# EAGLE design SparkFun_Thing_Plus_NINA-B306 (EAGLE 9.6.2)
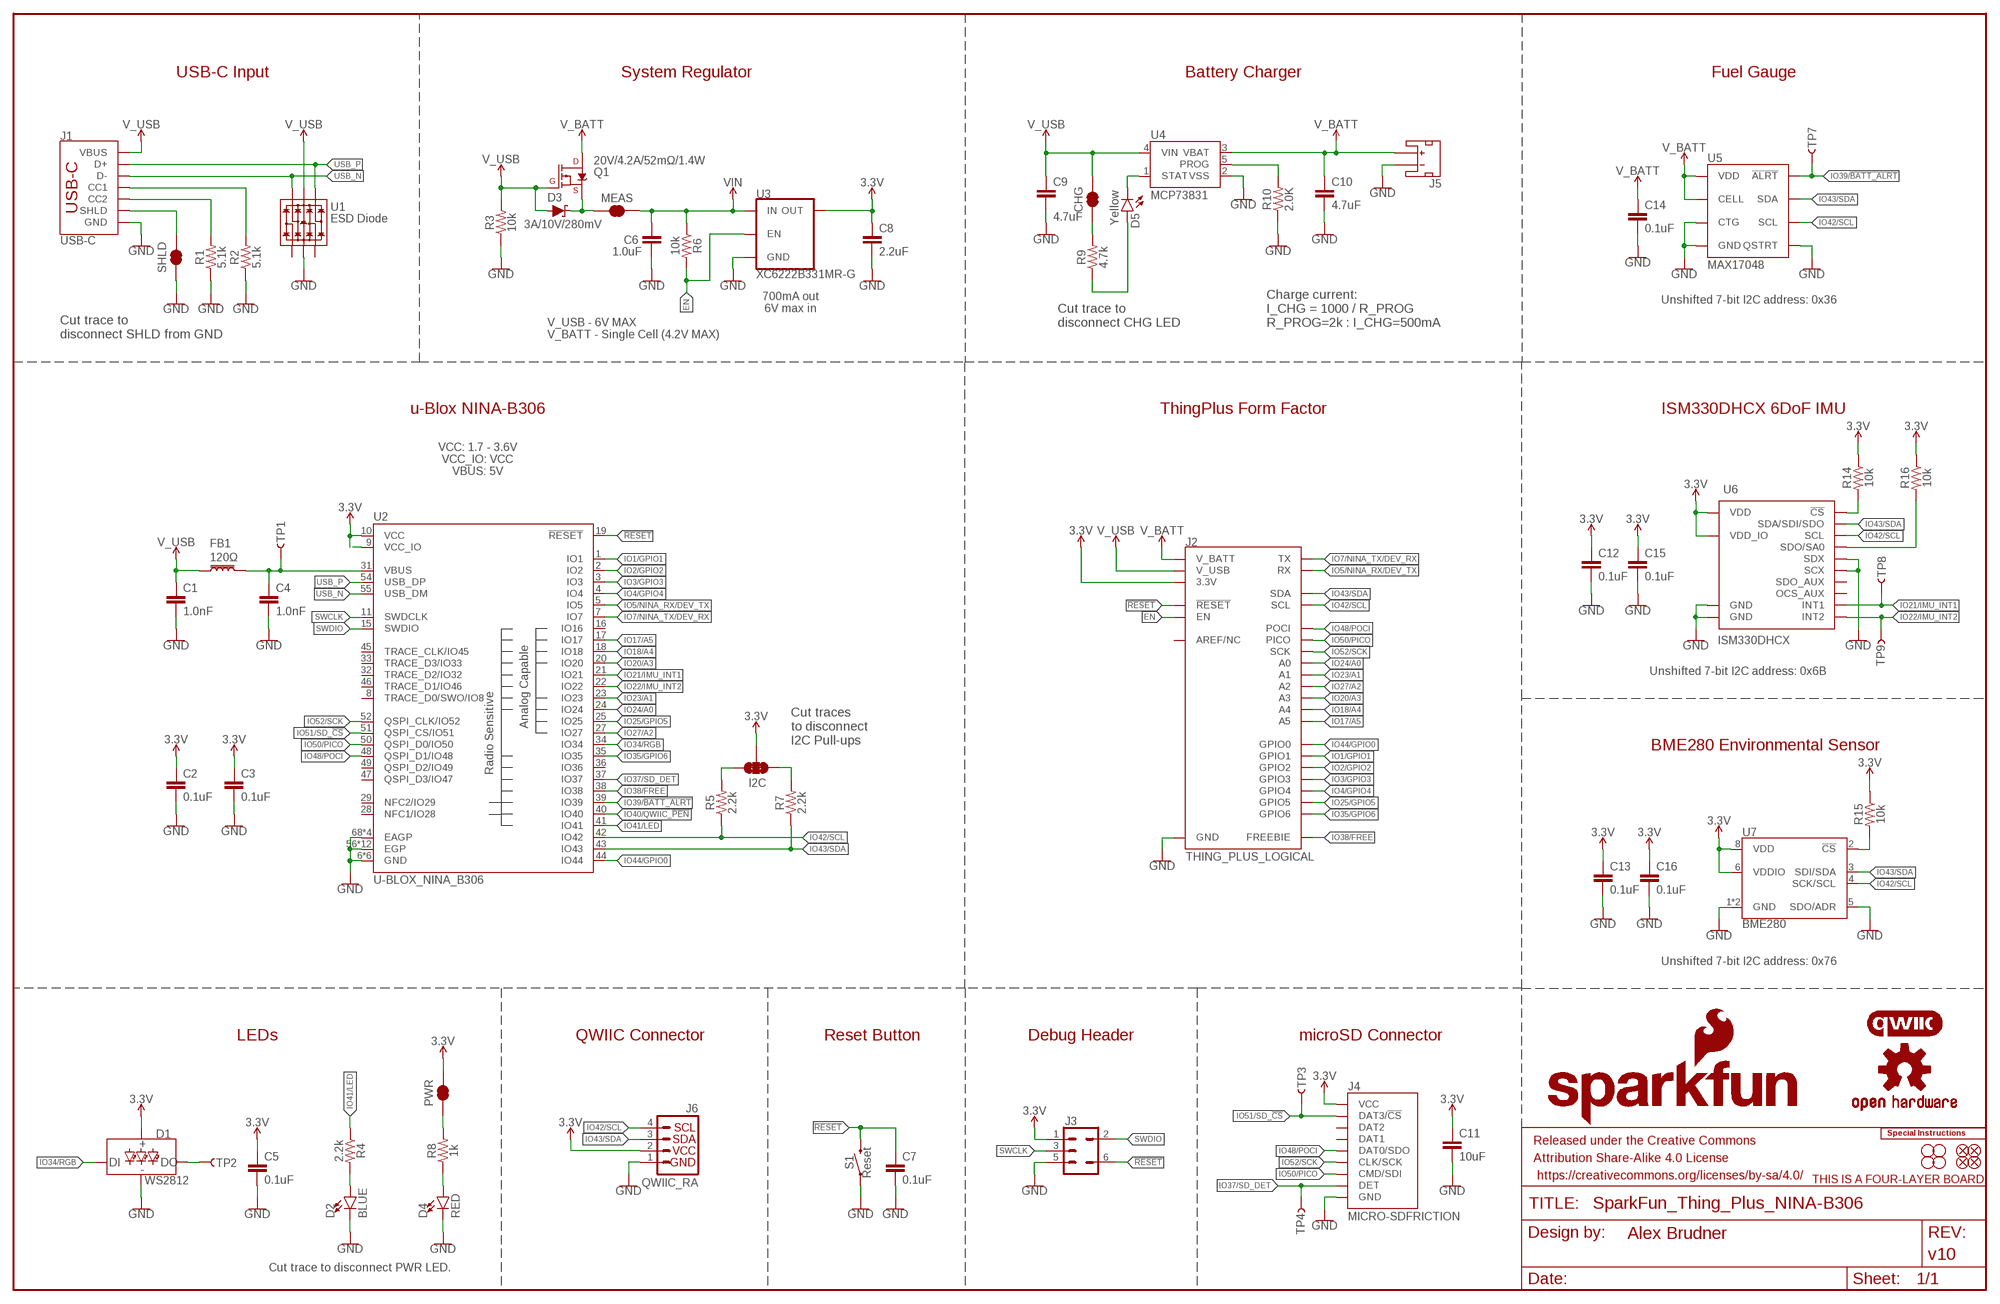
[diagram p0: schematic, sheet 1]

## Parts
C1  1.0nF  1.0NF/1000PF-0402_TIGHT-50V-10%  [0402-TIGHT]
C2  0.1uF  0.1UF-0402T-6.3V-10%-X7R  [0402-TIGHT]
C3  0.1uF  0.1UF-0402T-6.3V-10%-X7R  [0402-TIGHT]
C4  1.0nF  1.0NF/1000PF-0402_TIGHT-50V-10%  [0402-TIGHT]
C5  0.1uF  0.1UF-0402T-6.3V-10%-X7R  [0402-TIGHT]
C6  1.0uF  1.0UF-0402T-16V-10%  [0402-TIGHT]
C7  0.1uF  0.1UF-0402T-10V-10%-X7R  [0402-TIGHT]
C8  2.2uF  2.2UF-0402_TIGHT-10V-10%-X5R  [0402-TIGHT]
C9  4.7uF  4.7UF-0402_TIGHT-6.3V-20%-X5R  [0402-TIGHT]
C10  4.7uF  4.7UF-0402_TIGHT-6.3V-20%-X5R  [0402-TIGHT]
C11  10uF  10UF-0402T-6.3V-20%  [0402-TIGHT]
C12  0.1uF  0.1UF-0402T-6.3V-10%-X7R  [0402-TIGHT]
C13  0.1uF  0.1UF-0402T-6.3V-10%-X7R  [0402-TIGHT]
C14  0.1uF  0.1UF-0402T-10V-10%-X7R  [0402-TIGHT]
C15  0.1uF  0.1UF-0402T-6.3V-10%-X7R  [0402-TIGHT]
C16  0.1uF  0.1UF-0402T-6.3V-10%-X7R  [0402-TIGHT]
CHG  JUMPER-SMT_2_NC_TRACE_SILK  [SMT-JUMPER_2_NC_TRACE_SILK]
D1  WS2812  WS2812_2020  [WS2812-2020]
D2  BLUE  LED-BLUE0603  [LED-0603]
D3  3A/10V/280mV  DIODE-SCHOTTKY-BAT60A  [SOD-323]
D4  RED  LED-RED0603  [LED-0603]
D5  Yellow  LED-YELLOW0603  [LED-0603]
FB1  120Ω  FERRITE_BEAD-120_OHM-0402  [0402]
FD1  FIDUCIALUFIDUCIAL  [FIDUCIAL-MICRO]
FD2  FIDUCIALUFIDUCIAL  [FIDUCIAL-MICRO]
FD3  FIDUCIALUFIDUCIAL  [FIDUCIAL-MICRO]
FD4  FIDUCIALUFIDUCIAL  [FIDUCIAL-MICRO]
FRAME1  FRAME-LEDGER  [CREATIVE_COMMONS]
H1  STAND-OFFTIGHT  [STAND-OFF-TIGHT]
H2  STAND-OFFTIGHT  [STAND-OFF-TIGHT]
H3  STAND-OFFTIGHT  [STAND-OFF-TIGHT]
H4  STAND-OFFTIGHT  [STAND-OFF-TIGHT]
I2C  JUMPER-SMT_3_2-NC_TRACE_SILK  [SMT-JUMPER_3_2-NC_TRACE_SILK]
J1  USB-C  USB_C_4-LAYER-ISOLATED  [USB-C-16P-4LAYER-ISOLATED]
J2  THING_PLUS_LOGICAL  [THING_PLUS]
J3  CONN_03X2_NO4  [PAD_05_03X2_TP_NO4]
J4  MICRO-SDFRICTION  [MICROSD_TINY]
J5  JST_2MM_MALE  [JST-2-SMD]
J6  QWIIC_RA  QWIIC_CONNECTORJS-1MM  [JST04_1MM_RA]
LOGO1  SFE_LOGO_NAME_FLAME.1_INCH  [SFE_LOGO_NAME_FLAME_.1]
LOGO2  FOUR_LAYER_WARNING  [FOUR_LAYER_WARNING]
LOGO3  SPECIAL_INSTRUCTIONS-ORDERING  [ORDERING_INSTRUCTIONS]
LOGO4  QWIIC_LOGO_4MM  [QWIIC_4MM]
LOGO5  OSHW-LOGOMINI  [OSHW-LOGO-MINI]
MEAS  JUMPER-COMBO_2_NC_TRACE  [COMBO-JUMPER_2_NC_TRACE]
PWR  JUMPER-SMT_2_NC_TRACE_SILK  [SMT-JUMPER_2_NC_TRACE_SILK]
Q1  20V/4.2A/52mΩ/1.4W  MOSFET_PCH-DMG2305UX-7  [SOT23-3]
R1  5.1k  5.1KOHM-0402T-1/16W-1%  [0402-TIGHT]
R2  5.1k  5.1KOHM-0402T-1/16W-1%  [0402-TIGHT]
R3  10k  10KOHM-0402T-1/16W-1%  [0402-TIGHT]
R4  2.2k  2.2KOHM-0402T-1/16W-1%  [0402-TIGHT]
R5  2.2k  2.2KOHM-0402T-1/16W-1%  [0402-TIGHT]
R6  10k  10KOHM-0402T-1/16W-1%  [0402-TIGHT]
R7  2.2k  2.2KOHM-0402T-1/16W-1%  [0402-TIGHT]
R8  1k  1KOHM-0402T-1/16W-1%  [0402-TIGHT]
R9  4.7k  4.7KOHM-0402T-1/16W-1%  [0402-TIGHT]
R10  2.0K  2.0KOHM-0402T-1/16W-1%  [0402-TIGHT]
R14  10k  10KOHM-0402T-1/16W-1%  [0402-TIGHT]
R15  10k  10KOHM-0402T-1/16W-1%  [0402-TIGHT]
R16  10k  10KOHM-0402T-1/16W-1%  [0402-TIGHT]
S1  Reset  MOMENTARY-SWITCH-SPST-SMD-4.6X2.8MM  [TACTILE_SWITCH_SMD_4.6X2.8MM]
SHLD  JUMPER-SMT_2_NC_TRACE_SILK  [SMT-JUMPER_2_NC_TRACE_SILK]
TP1  TEST-POINT3X5  [PAD.03X.05]
TP2  TEST-POINT3X5  [PAD.03X.05]
TP3  TEST-POINT3X5  [PAD.03X.05]
TP4  TEST-POINT3X5  [PAD.03X.05]
TP7  TEST-POINT3X5  [PAD.03X.05]
TP8  TEST-POINT3X5  [PAD.03X.05]
TP9  TEST-POINT3X5  [PAD.03X.05]
U1  ESD Diode  TVS_DIODE_ARRAY_DT1042-04SO-7  [SOT-23-6]
U2  U-BLOX_NINA_B306  [NINA_B306]
U3  XC6222B331MR-G  [SOT23-5]
U4  MCP73831  [SOT23-5]
U5  MAX17048  MAX17048DFN8  [DFN-8]
U6  ISM330DHCX  [LGA-14L]
U7  BME280  [LGA-8-2.5X2.5]

## Nets
3.3V [power]: C2.1 C3.1 C5.1 C8.1 C11.1 C12.1 C13.1 C15.1 C16.1 D1.VCC I2C.2 J2.27(3.3V) J3.1 J4.4(VCC) J6.2 PWR.2 R14.1 R15.1 R16.1 U2.9(VCC_IO) U2.10(VCC) U3.5(OUT) U6.P5(VDD_IO) U6.P8(VDD) U7.6(VDDIO) U7.8(VDD)
!RESET!: C7.1 J2.28(!RESET) J3.6 S1.3 S1.4 U2.19(!RESET!)
EN: J2.11(EN) R6.2 U3.3(EN)
GND [ground]: C1.2 C2.2 C3.2 C4.2 C5.2 C6.2 C7.2 C8.2 C9.2 C10.2 C11.2 C12.2 C13.2 C14.2 C15.2 C16.2 D1.GND D2.C D4.C J1.GND J1.GND2(GND) J2.25(GND) J3.5 J4.6(GND) J4.GND1(GND) J4.GND2(GND) J4.GND3(GND) J4.GND4(GND) J4.GND5(GND) J4.GND6(GND) J5.1(-) J6.1 R1.1 R2.1 R3.1 R10.1 S1.1 S1.2 SHLD.1 U1.2(VSS) U2.6(GND) U2.12(GND) U2.14(GND) U2.26(GND) U2.30(GND) U2.53(GND) U2.56(EGP) U2.57(EGP) U2.58(EGP) U2.59(EGP) U2.60(EGP) U2.61(EGP) U2.62(EGP) U2.63(EGP) U2.64(EGP) U2.65(EGP) U2.66(EGP) U2.67(EGP) U2.68(EAGP) U2.69(EAGP) U2.70(EAGP) U2.71(EAGP) U3.2(GND) U4.2(VSS) U5.1(CTG) U5.4(GND) U5.6(QSTRT) U5.9(GND) U6.P2(SDX) U6.P3(SCX) U6.P6(GND) U6.P7(GND) U7.1(GND) U7.5(SDO/ADR) U7.7(GND)
IO1/GPIO1: J2.8(GPIO1) U2.1(IO1)
IO2/GPIO2: J2.7(GPIO2) U2.2(IO2)
IO3/GPIO3: J2.6(GPIO3) U2.3(IO3)
IO4/GPIO4: J2.5(GPIO4) U2.4(IO4)
IO5/NINA_RX/DEV_TX [HS_digital]: J2.15(RX) U2.5(IO5)
IO7/NINA_TX/DEV_RX [HS_digital]: J2.14(TX) U2.7(IO7)
IO17/A5 [analog]: J2.19(A5) U2.17(IO17)
IO18/A4 [analog]: J2.20(A4) U2.18(IO18)
IO20/A3 [analog]: J2.21(A3) U2.20(IO20)
IO21/IMU_INT1: TP8.1 U2.21(IO21) U6.P4(INT1)
IO22/IMU_INT2: TP9.1 U2.22(IO22) U6.P9(INT2)
IO23/A1 [analog]: J2.23(A1) U2.23(IO23)
IO24/A0 [analog]: J2.24(A0) U2.24(IO24)
IO25/GPIO5: J2.4(GPIO5) U2.25(IO25)
IO27/A2 [analog]: J2.22(A2) U2.27(IO27)
IO34/RGB: D1.DI U2.34(IO34)
IO35/GPIO6: J2.3(GPIO6) U2.35(IO35)
IO37/SD_DET: J4.9(DET) TP4.1 U2.37(IO37)
IO38/FREE: J2.13(FREEBIE) U2.38(IO38)
IO39/!BATT_ALRT!: TP7.1 U2.39(IO39) U5.5(!ALRT)
IO40/QWIIC_!PEN!: U2.40(IO40)
IO41/LED: R4.1 U2.41(IO41)
IO42/SCL [HS_digital]: J2.2(SCL) J6.4 R5.1 U2.42(IO42) U5.7(SCL) U6.P13(SCL) U7.4(SCK/SCL)
IO43/SDA [HS_digital]: J2.1(SDA) J6.3 R7.1 U2.43(IO43) U5.8(SDA) U6.P14(SDA/SDI/SDO) U7.3(SDI/SDA)
IO44/GPIO0: J2.9(GPIO0) U2.44(IO44)
IO48/POCI [HS_digital]: J2.16(POCI) J4.7(DAT0/SDO) U2.48(QSPI_D1/IO48)
IO50/PICO [HS_digital]: J2.17(PICO) J4.3(CMD/SDI) U2.50(QSPI_D0/IO50)
IO51/SD_!CS!: J4.2(DAT3/!CS!) TP3.1 U2.51(QSPI_CS/IO51)
IO52/SCK [HS_digital]: J2.18(SCK) J4.5(CLK/SCK) U2.52(QSPI_CLK/IO52)
N$2: J1.B5(CC2) R1.2
N$3: J1.A5(CC1) R2.2
N$4: D5.A R9.1
N$5: D5.C U4.1(STAT)
N$6: R10.2 U4.5(PROG)
N$8: CHG.1 R9.2
N$10: D4.A R8.1
N$11: PWR.1 R8.2
N$12 [power]: D3.C MEAS.1 MEAS.3 Q1.2(S)
N$14: D1.DO TP2.1
N$15: R15.2 U7.2(!CS)
N$16: D2.A R4.2
N$18: R14.2 U6.P12(!CS!)
N$19: R16.2 U6.P1(SDO/SA0)
N$20: C4.1 FB1.2 TP1.1 U2.31(VBUS)
SCL_PU_PWR: I2C.3 R5.2
SDA_PU_PWR: I2C.1 R7.2
SHLD [ground]: J1.SHLD1(SHLD) J1.SHLD2(SHLD) J1.SHLD3(SHLD) J1.SHLD4(SHLD) J1.SHLD5(SHLD) J1.SHLD6(SHLD) J1.SHLD7(SHLD) J1.SHLD8(SHLD) SHLD.2
SWCLK [HS_digital]: J3.3 U2.11(SWDCLK)
SWDIO [HS_digital]: J3.2 U2.15(SWDIO)
USB_N [usb_diff]: J1.A7(D-) J1.B7(D-) U1.6(IO4) U2.55(USB_DM)
USB_P [usb_diff]: J1.A6(D+) J1.B6(D+) U1.4(IO3) U2.54(USB_DP)
V_BATT [power]: C10.1 C14.1 J2.12(V_BATT) J5.2(+) Q1.3(D) U4.3(VBAT) U5.2(CELL) U5.3(VDD)
V_USB [power]: C1.1 C9.1 CHG.2 D3.A FB1.1 J1.VBUS1(VBUS) J1.VBUS2(VBUS) J2.10(V_USB) Q1.1(G) R3.2 U1.5(VCC) U4.4(VIN)
VIN [power]: C6.1 MEAS.2 MEAS.4 R6.1 U3.1(IN)
Unconnected: J2.26(AREF/NC) J4.1(DAT2) J4.8(DAT1) J5.NC1(PAD1) J5.NC2(PAD2) U1.1(IO1) U1.3(IO2) U2.8(TRACE_D0/SWO/IO8) U2.16(IO16) U2.28(NFC1/IO28) U2.29(NFC2/IO29) U2.32(TRACE_D2/IO32) U2.33(TRACE_D3/IO33) U2.36(IO36) U2.45(TRACE_CLK/IO45) U2.46(TRACE_D1/IO46) U2.47(QSPI_D3/IO47) U2.49(QSPI_D2/IO49) U6.P10(OCS_AUX) U6.P11(SDO_AUX)

## Notes on the sheet
- USB-C Input | System Regulator | Battery Charger | Fuel Gauge
- 700mA out
  6V max in
- Unshifted 7-bit I2C address: 0x36
- Cut trace to 
  disconnect CHG LED
- Charge current:
  I_CHG = 1000 / R_PROG
  R_PROG=2k : I_CHG=500mA
- Cut trace to 
  disconnect SHLD from GND
- V_USB - 6V MAX
  V_BATT - Single Cell (4.2V MAX)
- u-Blox NINA-B306 | ThingPlus Form Factor | ISM330DHCX 6DoF IMU
- VCC: 1.7 - 3.6V
  VCC_IO: VCC
  VBUS: 5V
- Unshifted 7-bit I2C address: 0x6B
- Cut traces 
  to disconnect 
  I2C Pull-ups
- BME280 Environmental Sensor
- Unshifted 7-bit I2C address: 0x76
- LEDs | QWIIC Connector | Reset Button | Debug Header | microSD Connector
- Cut trace to disconnect PWR LED.

## Library data of the parts
C1 C4 = SparkFun-Capacitors:1.0NF/1000PF: 1nF/1,000pF ceramic capacitors A capacitor is a passive two-terminal electrical component used to store electrical energy temporarily in an electric field.; PROD_ID: CAP-14280
C2 C3 C5 C12 C13 C15 C16 = SparkFun-Capacitors:0.1UF: 0.1µF ceramic capacitors A capacitor is a passive two-terminal electrical component used to store electrical energy temporarily in an electric field.; PROD_ID: CAP-14993
C6 = SparkFun-Capacitors:1.0UF: 1µF ceramic capacitors A capacitor is a passive two-terminal electrical component used to store electrical energy temporarily in an electric field.; PROD_ID: CAP-12417
C7 C14 = SparkFun-Capacitors:0.1UF: 0.1µF ceramic capacitors A capacitor is a passive two-terminal electrical component used to store electrical energy temporarily in an electric field.; PROD_ID: CAP-15083
C8 = SparkFun-Capacitors:2.2UF: 2.2µF ceramic capacitors A capacitor is a passive two-terminal electrical component used to store electrical energy temporarily in an electric field.; PROD_ID: CAP-14232
C9 C10 = SparkFun-Capacitors:4.7UF: 4.7µF ceramic capacitors A capacitor is a passive two-terminal electrical component used to store electrical energy temporarily in an electric field.; PROD_ID: CAP-14240
C11 = SparkFun-Capacitors:10UF: 10.0µF ceramic capacitors A capacitor is a passive two-terminal electrical component used to store electrical energy temporarily in an electric field.; PROD_ID: CAP-14848
CHG PWR SHLD = SparkFun-Jumpers:JUMPER-SMT_2_NC_TRACE: Normally closed trace jumper This jumper has a trace between two pads so it's normally closed (NC). Use a razor knife to open the connection. For best results follow the IPC guidelines for cutting traces: Cutout at least 0.063 mm (0.005 in). Remove all loose material to clean up the cut area. Seal the cut with an approved epoxy. Reapply solder to reclose the connection.
D1 = SparkFun-LED:WS2812: Addressable RGB LED - 1 Wire Common names: WS2812, SK6812, Neopixel, APA-106, etc. SMD LED with built-in controller IC. Color: Red/Green/Blue SparkFun Products: LED-SMD RGB (WS2812) <https://www.sparkfun.com/products/11821> LED - RGB Addressable, PTH, 5mm Diffused (5 Pack) <https://www.sparkfun.com/products/12986> LED - RGB Addressable, PTH, 5mm Clear (5 Pack) <https://www.sparkfun.com/products/12999> Blynk Board - ESP8266 <https://www.sparkfun.com/products/13794> Datasheet referenced for footprint: WS2812B-PTH <https://cdn.sparkfun.com/datasheets/Components/LED/COM-12877.pdf>; PROD_ID: DIO-15591
D2 = SparkFun-LED:LED-BLUE: Blue SMD LED Used in manufacturing of various products at SparkFun Packages: 0603 - SMD 0603 package [Product Link] <http://www.digikey.com/product-detail/en/SMLE12BC7TT86/511-1589-2-ND/1641808> 1206 - SMD1206 package [Product Link] <http://www.digikey.com/product-detail/en/lite-on-inc/LTST-C150TBKT/160-1643-1-ND/573584> SparkFun Products: ESP8266 Thing-Dev Board <https://www.sparkfun.com/products/13711> RedBoard <https://www.sparkfun.com/products/12757>; PROD_ID: DIO-08575
D3 = SparkFun-DiscreteSemi:DIODE-SCHOTTKY: Schottky diode A Schottky diode is a semiconductor diode which has a low forward voltage drop and a very fast switching action.; PROD_ID: DIO-14072
D4 = SparkFun-LED:LED-RED: Red SMD LED Used in manufacturing of most products at SparkFun Packages: 0603 - SMD 0603 package [Product Link] <http://docs.avagotech.com/docs/AV02-0551EN> 0603 SMART - SMD 0603 SMART package ( more efficient and expensive)[Product Link] <http://www.osram-os.com/Graphics/XPic2/00077099_0.pdf> 1206 - SMD1206 package [Product Link] <https://www.sparkfun.com/datasheets/DevTools/LilyPad/Q150OVS4.pdff> SparkFun Products: Pro Mini 328 -5V <https://www.sparkfun.com/products/821> RedBoard <https://www.sparkfun.com/products/12757> IOIO-OTG <https://www.sparkfun.com/products/13613>; PROD_ID: DIO-00819
D5 = SparkFun-LED:LED-YELLOW: Yellow SMD LED Used in manufacturing several products at SparkFun. Packages: 0603 - SMD 0603 package[Product Link] <http://www.kingbrightusa.com/product.asp?catalog_name=LED&product_id=APT1608SYCK> 0603 -SMART - SMART SMD 0603 package (more efficient/more expensive) [Product Link] <http://www.osram-os.com/osram_os/en/products/product-catalog/led-light-emitting-diodes/smartled-0603/ly-l29k/index.jsp> LilyPad - SMD1206 package[Product Datasheet] <https://www.sparkfun.com/datasheets/DevTools/LilyPad/Q150YUS4.pdf> SparkFun Products: Blynk Board <https://www.sparkfun.com/products/13794> IOIO-OTG <https://www.sparkfun.com/products/13613> XBee Explorer Serial <https://www.sparkfun.com/products/13225>; PROD_ID: DIO-09003
FB1 = SparkFun-Coils:FERRITE_BEAD-120_OHM: Ferrite Bead (blocks, cores, rings, chokes, etc.) Inductor with layers of ferrite used to suppress high frequencies. Often used to isolate high frequency noise.; MFG_PART: BLM15HB121SN1D; PROD_ID: NDUC-14206
FD1-FD4 = SparkFun-Aesthetics:FIDUCIAL: Fiducial Alignment Points Point-of-reference for pick-and-place machines and other optical instruments.
FRAME1 = SparkFun-Aesthetics:FRAME-LEDGER: Schematic Frame - Ledger Standard 11x14 US Ledger frame; DESIGNER: Alex Brudner; REV: v10
H1-H4 = SparkFun-Hardware:STAND-OFF: Stand Off Drill holes for mechanically mounting via screws, standoffs, etc. Note: Use the keepout ring to avoid running the screw head into surrounding components. Variant Overviews STAND-OFF - Mechanical footprint for a #4 phillips button head screw. STAND-OFF-TIGHT - Mechanical footprint for a #4 phillips button head screw, Example SparkFun Products Screw - Phillips Head (1/4", 4-40, 10 pack) <https://www.sparkfun.com/products/10453> (PRT-10453) Screw - Phillips Head (1/2", 4-40, 10 pack) <https://www.sparkfun.com/products/10452> (PRT-10452) Screw - Phillips Head (3/4", 4-40, 10 pack) <https://www.sparkfun.com/products/10451> (PRT-10451) Screw - Phillips Head (1", 4-40, 10 pack) <https://www.sparkfun.com/products/10450> (PRT-10450)
I2C = SparkFun-Jumpers:JUMPER-SMT_3_2-NC_TRACE: Normally closed trace jumper (2 of 2 connections) This jumper has a trace between all three pads so they are normally closed (NC). Use a razor knife to open the connection(s). For best results follow the IPC guidelines for cutting traces: Cutout at least 0.063 mm (0.005 in). Remove all loose material to clean up the cut area. Seal the cut with an approved epoxy. Reapply solder to reclose the connection(s).
J1 = SparkFun-Connectors:USB_C: USB Type C 16Pin Connector Super Speed pins not available on the 16-pin purely SMD connector so this part is best for USB 2.0 implementations. D1 and D2 are tied together enabling D+/- no matter which way the cable is plugged into the connector. The two channel configuration pins (CC1/2) are exposed. These are normally connected to ground via 5.1k resistors but can be reconfigured for high current/high power applications. **4-LAYER BOARD WARNING!!** If designing 4-layer board, make sure to select the variant _4-LAYER-ISOLATED. The linked footprint (USB-C-16-4LAYER-ISOLATED) includes some very necessary cutout polygons in the inner layers (2 and 15). This prevents the PTH mounting shield legs on the USB connector from electrically connecting any other polygons on the inner layers (usually VCC and GND).; PROD_ID: CONN-14122; VALUE: USB Female Type C Connector
J2 = SparkFun-Boards:THING_PLUS_LOGICAL
J3 = MISC:CONN_03X2_NO4
J4 = SparkFun-Connectors:MICRO-SD: microSD Socket for Transflash Various sockets for µSD. tDoc lines correctly indicate media card edge positions when inserting (unlocked, locked, depressed). NOTE: CD1 and CD2 are connected internally, and the default detect state of the socket is detect pin to ground. SparkFun Products: WAV Trigger <https://www.sparkfun.com/products/13660> CAN-Bus Shield <https://www.sparkfun.com/products/13262> SparkFun Level Shifing microSD Breakout <https://www.sparkfun.com/products/13743>; PROD_ID: CONN-13500
J5 = SparkFun-Connectors:JST_2MM_MALE: JST 2MM MALE RA CONNECTOR Two pin, compact surface mount connector. Commonly used as a battery input connection point. We really like the solid locking feeling and high current rating on these small connectors. We use these all the time as battery connectors. Mates to single-cell LiPo batteries. Here is the connector we sell at SparkFun: JST Right Angle Connector - White <https://www.sparkfun.com/products/8612> (PRT-08612) Datasheet <http://www.sparkfun.com/datasheets/Prototyping/Connectors/JST-Horizontal.pdf> It was used on these SparkFun products: SparkFun MOSFET Power Controller <https://www.sparkfun.com/products/11214> (PRT-11214) SparkFun Battery Babysitter - LiPo Battery Manager <https://www.sparkfun.com/products/13777> (PRT-13777) And many, many others that required a lipo battery connection.; PROD_ID: CONN-11443; SF_ID: PRT-08612
J6 = SparkFun-Connectors:QWIIC_CONNECTOR: SparkFun I2C Standard Qwiic Connector An SMD 1mm pitch JST connector makes it easy and quick (get it? Qwiic?) to connect I2C devices to each other. The Qwiic system <http://www.sparkfun.com/qwiic> enables fast and solderless connection between popular platforms and various sensors and actuators. We carry 200mm <https://www.sparkfun.com/products/14204>, 100mm <https://www.sparkfun.com/products/14205>, 50mm <https://www.sparkfun.com/products/14206>, and breadboard friendly <https://www.sparkfun.com/products/14207> Qwiic cables. We also offer 10 pcs strips <https://www.sparkfun.com/products/14323> the SMD connectors.; PROD_ID: CONN-13694; VALUE: QWIIC_RIGHT_ANGLE
LOGO1 = SparkFun-Aesthetics:SFE_LOGO_NAME_FLAME: SparkFun Font Logo w/ Flame This is the SparkFun full logo. The logo on the schematic will always be the same size; the package variant is the height of the flame part of the logo. Default layer for the logo on the board is tSilk.
LOGO2 = SparkFun-Aesthetics:FOUR_LAYER_WARNING: Four-Layer Board Warning - tDoc Layer Warning text which will appear on both the schematic and the board file, notifying viewers that the design is a four-layer PCB.
LOGO3 = SparkFun-Aesthetics:SPECIAL_INSTRUCTIONS: Special Ordering/Production Instructions Alert Symbol for special PCB ordering instructions or unique production process warnings. Ordering Instructions Production Instructions Types of information that should be added to box: Copper weight Soldermask color Silk color PCB thickness Number of layers PCB Standard: 1.6mm FR4 1 oz copper immersion silver plating red soldermask white silkscreen Types of information that should be added to box: Special wash requirements Depaneling instructions Humidification Glue curing Default text settings: 0.07 inch 9% ratio 50% line distance
LOGO4 = SparkFun-Aesthetics:QWIIC_LOGO: Qwiic Logos for placement on schematic and PCB. The 5.5mm silk logo is best for placing next to Qwiic connector.
LOGO5 = SparkFun-Aesthetics:OSHW-LOGO: Open-Source Hardware (OSHW) Logo This logo indicates the piece of hardware it is found on incorporates a OSHW license and/or adheres to the definition of open source hardware found here: http://freedomdefined.org/OSHW
MEAS = SparkFun-Jumpers:JUMPER-COMBO_2_NC_TRACE
Q1 = SparkFun-DiscreteSemi:MOSFET_PCH: P-channel MOSFETs Voltage controlled devices that allow control of high current outputs. SparkFun Products: SparkFun ESP32 Thing <https://www.sparkfun.com/products/13907> SparkFun ESP8266 Thing <https://www.sparkfun.com/products/13231> SparkFun Pi Servo HAT V2 <https://www.sparkfun.com/products/15316> DMG2305UX-7 (20V/4.2A/SOT23-3); PROD_ID: TRANS-14388
R1 R2 = SparkFun-Resistors:5.1KOHM; PROD_ID: RES-14340
R3 R6 R14-R16 = SparkFun-Resistors:10KOHM: 10kΩ resistor A resistor is a passive two-terminal electrical component that implements electrical resistance as a circuit element. Resistors act to reduce current flow, and, at the same time, act to lower voltage levels within circuits. - Wikipedia; PROD_ID: RES-14241
R4 R5 R7 = SparkFun-Resistors:2.2KOHM: 2.2kΩ resistor A resistor is a passive two-terminal electrical component that implements electrical resistance as a circuit element. Resistors act to reduce current flow, and, at the same time, act to lower voltage levels within circuits. - Wikipedia; PROD_ID: RES-14341
R8 = SparkFun-Resistors:1KOHM: 1kΩ resistor A resistor is a passive two-terminal electrical component that implements electrical resistance as a circuit element. Resistors act to reduce current flow, and, at the same time, act to lower voltage levels within circuits. - Wikipedia; PROD_ID: RES-14342
R9 = SparkFun-Resistors:4.7KOHM: 4.7kΩ resistor A resistor is a passive two-terminal electrical component that implements electrical resistance as a circuit element. Resistors act to reduce current flow, and, at the same time, act to lower voltage levels within circuits. - Wikipedia; PROD_ID: RES-15343
R10 = SparkFun-Resistors:2.0KOHM: 2kΩ resistor A resistor is a passive two-terminal electrical component that implements electrical resistance as a circuit element. Resistors act to reduce current flow, and, at the same time, act to lower voltage levels within circuits. - Wikipedia; PROD_ID: RES-15406
S1 = SparkFun-Switches:MOMENTARY-SWITCH-SPST: Momentary Switch (Pushbutton) - SPST Normally-open (NO) SPST momentary switches (buttons, pushbuttons). Variants PTH-12MM - 12mm square, through-hole Momentary Pushbutton Switch - 12mm Square <https://www.sparkfun.com/products/9190> (COM-09190) PTH-6.0MM, PTH-6.0MM-KIT - 6.0mm square, through-hole Mini Pushbutton Switch <https://www.sparkfun.com/products/97> (COM-00097) KIT package intended for soldering kit's - only one side of pads' copper is exposed. PTH-RIGHT-ANGLE-KIT - Right-angle, through-hole Right Angle Tactile Button <https://www.sparkfun.com/products/10791> - Used on SparkFun BigTime Watch Kit <https://www.sparkfun.com/products/11734> SMD-12MM - 12mm square, surface-mount Tactile Button - SMD (12mm) <https://www.sparkfun.com/products/12993> (COM-12993) Used on SparkFun PicoBoard <https://www.sparkfun.com/products/11888> SMD-4.5MM - 4.5mm Square Trackball Switch Used on SparkFun Blackberry Trackballer Breakout <https://www.sparkfun.com/products/13169> SMD-4.6MMX2.8MM - 4.60mm x 2.80mm, surface mount Used on SparkFun Pro Micro - RP2040 <https://www.sparkfun.com/products/17717> SMD-5.2MM, SMD-5.2-REDUNDANT - 5.2mm square, surface-mount Mini Pushbutton Switch - SMD <https://www.sparkfun.com/products/8720> (COM-08720) Used on Arduino Pro Mini <https://www.sparkfun.com/products/11114> REDUNDANT package connects both switch circuits together SMD-6.0X3.5MM - 6.0 x 3.5mm, surface mount Momentary Reset Switch SMD <https://www.sparkfun.com/products/8229> (COM-08229) SMD-6.2MM-TALL - 6.2mm square, surface mount Tactile Button - SMD (6mm) <https://www.sparkfun.com/products/12992> Used on SparkFun Digital Sandbox <https://www.sparkfun.com/products/12651> SMD-RIGHT-ANGLE - Right-angle, surface mount Used on SparkFun Block for Intel® Edison - Arduino <https://www.sparkfun.com/products/13036>; PROD_ID: SWCH-15606
TP1-TP4 TP7-TP9 = SparkFun-Connectors:TEST-POINT: SparkFun Test Points Bare copper test points for troubleshooting or In-Circuit-Testing. These are used by our Production team for verifying production board runs using pogo-pins on test beds. SparkFun Products: SparkFun LSM9DS1 Breakout <https://www.sparkfun.com/products/13284> SparkFun PSOC <https://www.sparkfun.com/products/13714> SparkFun Load Cell Amplifier <https://www.sparkfun.com/products/13879>
U1 = SparkFun-DiscreteSemi:TVS_DIODE_ARRAY; PROD_ID: IC-13538
U2 = U-BLOX_NINA_B306:U-BLOX_NINA_B306: u-blox NINA B306 BLE Module A low energy bluetooth controller, using the nRF52840. Datasheet <https://www.u-blox.com/en/docs/UBX-17052099>; PROD_ID: IC-16760
U3 = SparkFun-IC-Power:XC6222; IOUT: 700mA; PROD_ID: VREG-16775; VOUT: 3.3V
U4 = SparkFun-IC-Power:MCP73831: MCP73831T Li-Ion, Li-Pol Controller Miniature single cell, fully integrated Li-Ion, Li-polymer charge management controller Datasheet <http://ww1.microchip.com/downloads/en/DeviceDoc/20001984g.pdf> SparkFun Products: SparkFun ESP32 Thing <https://www.sparkfun.com/products/13907> SparkFun 9DoF Razor IMU M0 <https://www.sparkfun.com/products/14001>; PROD_ID: IC-09995
U5 = SparkFun-IC-Power:MAX17048: Micropower 1-Cell Li+ ModelGauge SparkFun Products Qduino Mini <https://www.sparkfun.com/products/13614> (DEV-13614); PROD_ID: IC-12551
U6 = SparkFun-Sensors:ISM330DHCX: ISM330DHCX 6DoF The ISM330DHCX is a system-in-package featuring a high-performance 3D digital accelerometer and 3D digital gyroscope tailored for Industry 4.0 applications.; PROD_ID: IC-16693
U7 = SparkFun-Sensors:BME280: Bosch BME280 – Combined Humidity and Pressure Sensor The BME280 is as combined digital humidity, pressure and temperature sensor based on proven sensing principles. The sensor module is housed in an extremely compact metal-lid LGA package with a footprint of only 2.5×2.5mm² with a height of 0.93mm. Its small dimensions and its low power consumption allow the implementation in battery driven devices such as handsets, GPS modules or watches. Datasheet <https://cdn.sparkfun.com/assets/learn_tutorials/4/1/9/BST-BME280_DS001-10.pdf> SparkFun Products SparkFun Atmospheric Sensor Breakout - BME280 <https://www.sparkfun.com/products/13676> (SEN-13676); PROD_ID: IC-13090

## Net classes
0 default: width 0.11 mm, drill 0.3 mm, clearance 0.11 mm
1 power: width 0.2 mm, drill 0.3 mm, clearance 0.18 mm
2 ground: width 0.11 mm, drill 0.3 mm, clearance 0.2 mm to class 0, clearance 0.11 mm to class 1
3 analog: width 0.11 mm, drill 0.2 mm, clearance 0.2 mm to class 0, clearance 0.2 mm to class 1, clearance 0.2 mm to class 2, clearance 0.2 mm
4 HS_digital: width 0.11 mm, drill 0.3 mm, clearance 0.2 mm to class 0, clearance 0.3 mm to class 1, clearance 0.2 mm to class 2, clearance 0.2 mm to class 3, clearance 0.15 mm
5 usb_diff: width 0.2 mm, drill 0.2 mm, clearance 0.2 mm to class 0, clearance 0.2 mm to class 1, clearance 0.2 mm to class 2, clearance 0.2 mm to class 3, clearance 0.4 mm to class 4, clearance 0.15 mm

## Board
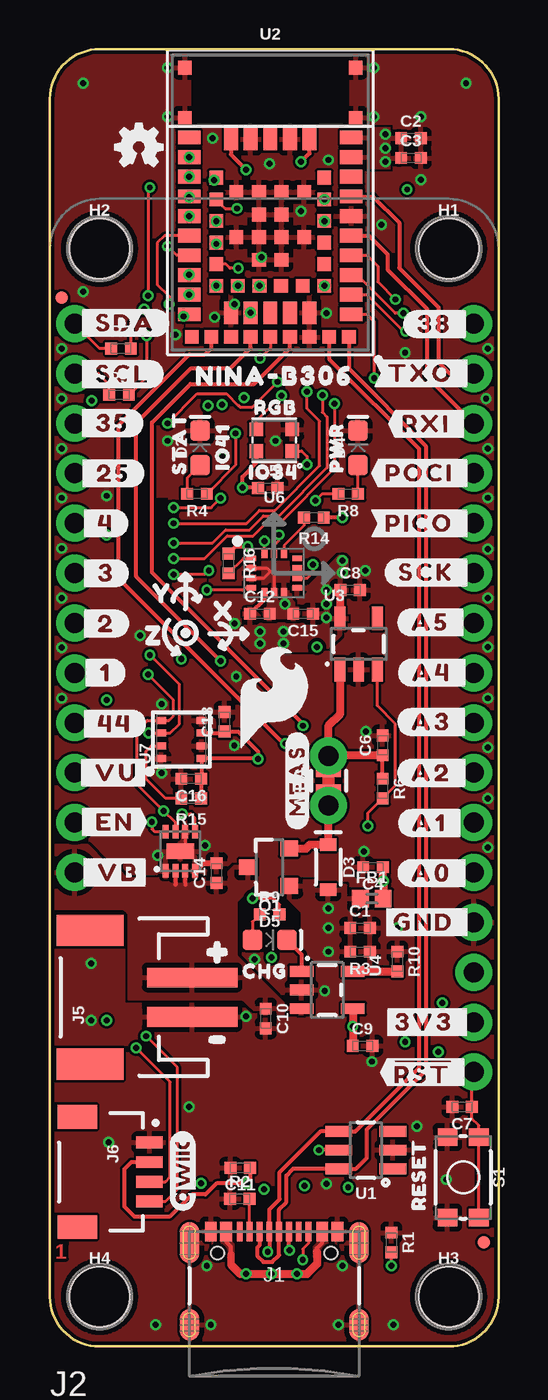
[diagram p1: board, top side]
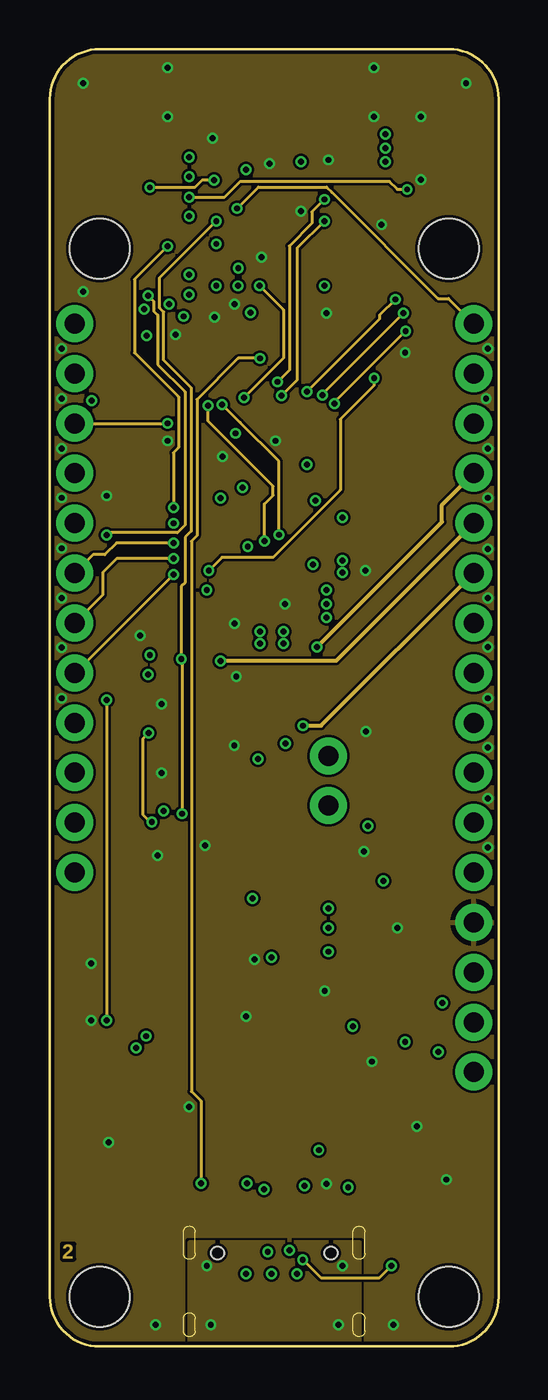
[diagram p2: board, inner layer Route2]
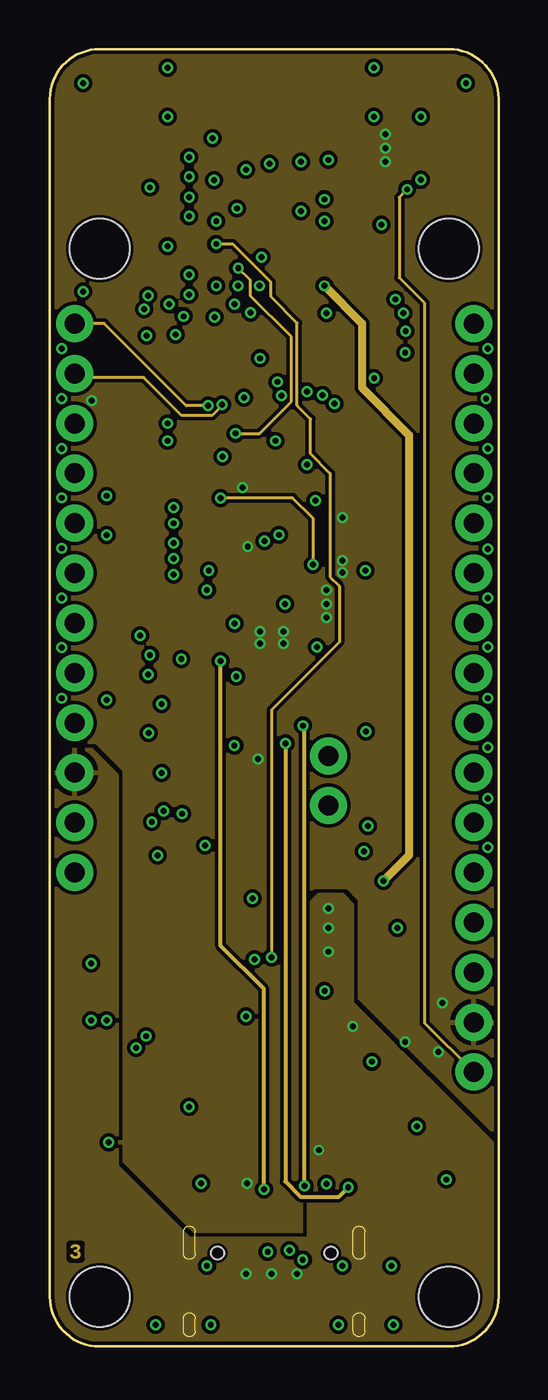
[diagram p3: board, inner layer Route15]
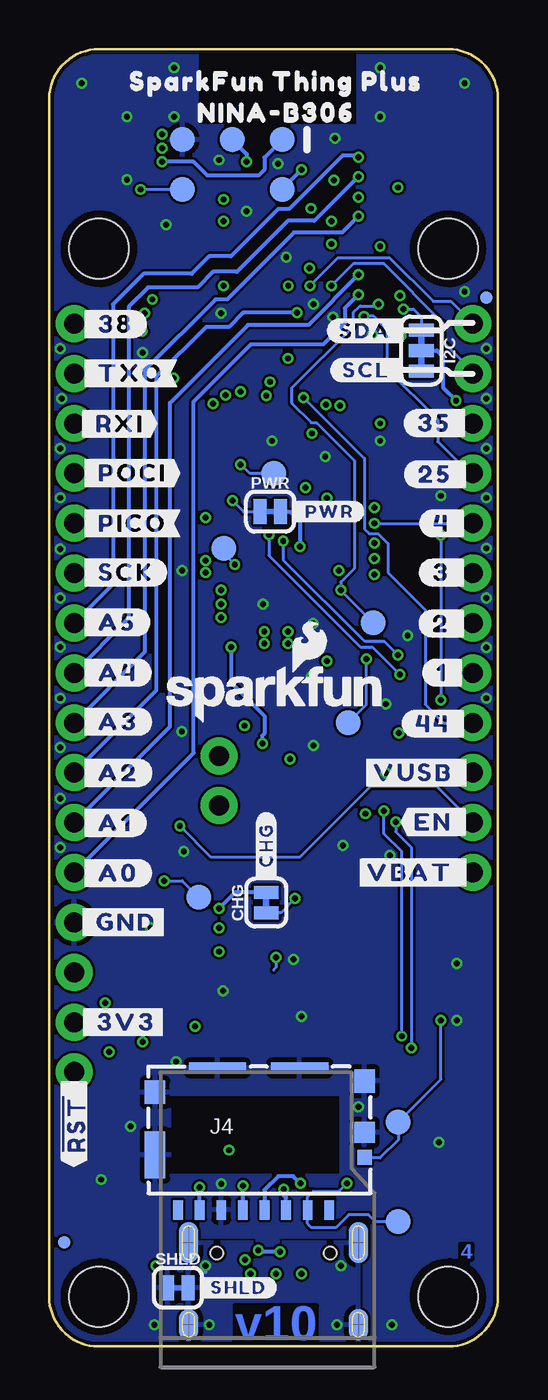
[diagram p4: board, bottom side, seen from below]

Size 22.86 x 66.04 mm. Coordinates in mm from the lower left corner, seen from the top.
Outline: 0,2.54 0,63.5 arc-90 2.54,66.04 20.31,66.04 arc-90 22.86,63.5 22.86,2.54 arc-90 20.32,0 2.54,0 arc-90 0,2.54
Copper layers (1*2*15*16): Top 0.035mm / dielectric 0.2104mm / Route2 0.0152mm / dielectric 1.065mm / Route15 0.0152mm / dielectric 0.2104mm / Bottom 0.035mm
Design rules "SparkFun-4-Layer-Minimum-JLCPCB *": minimum track width 0.1mm, minimum drill 0.2mm, track to track 5mil, track to pad 5mil, pad to pad 5mil, via to via 5mil, smd to smd 0mil, copper to edge 7mil, drill to drill 7mil, minimum pad ring 5mil, minimum via ring 5mil, stop-mask expansion 2.5mil, vias tented up to drill 25mil, thermal gap 10mil
tRestrict: area 11.6,38 to 11.8,38.5; area 9.9,39.3 to 10.4,39.4; area 5.6,43.1 to 6,43.2
bRestrict: area 16.9,33.3 to 17.1,33.4; area 17.6,35.3 to 17.8,35.4; area 18.3,37 to 18.5,37.1; area 18.2,49.7 to 18.4,49.8; area 19.1,38.7 to 19.3,38.8

### Footprints (pad centres in the part's own frame; a part is rotated, then mirrored left to right if it is on the bottom)
0402-TIGHT = smd 0.6 x 0.6: 1 -0.5,0; 2 0.5,0
SMT-JUMPER_2_NC_TRACE_SILK = smd 0.66 x 1.27: 1 -0.521,0; 2 0.521,0
WS2812-2020 = smd 0.7 x 0.7: DI -0.915,0.55; DO 0.915,-0.55; GND 0.915,0.55; VCC -0.915,-0.55
LED-0603 = smd 1 x 1: A -0.877,0; C 0.877,0
SOD-323 = smd 0.63 x 0.83: A 1.15,0; C -1.15,0
0402 = smd 0.85 x 0.9: 1 -0.58,0; 2 0.58,0
FIDUCIAL-MICRO = smd 0.635 x 0.635: 1 0,0
STAND-OFF-TIGHT = hole 3.048: 0,0
SMT-JUMPER_3_2-NC_TRACE_SILK = smd 0.66 x 1.27: 1 -1.041,0; 2 0,0; 3 1.041,0
USB-C-16P-4LAYER-ISOLATED = smd 0.3 x 1: A5 -1.25,-0.34; A6 -0.25,-0.34; A7 0.25,-0.34; A8 1.25,-0.34; B5 1.75,-0.34; B6 0.75,-0.34; B7 -0.75,-0.34; B8 -1.75,-0.34 | smd 0.6 x 1: GND -3.225,-0.34; GND2 3.225,-0.34; VBUS1 -2.45,-0.34; VBUS2 2.45,-0.34 | smd 1 x 2.1: SHLD1 -4.32,-0.915; SHLD2 4.32,-0.915 | smd 1 x 2.1 bottom: SHLD3 -4.32,-0.915; SHLD4 4.32,-0.915 | smd 1 x 1.6: SHLD5 -4.32,-5.095; SHLD8 4.32,-5.095 | smd 1 x 1.6 bottom: SHLD6 -4.32,-5.095; SHLD7 4.32,-5.095 | hole 0.65: -2.89,-1.445; 2.89,-1.445
THING_PLUS = drill 1.016 pad 1.88: 1 1.27,52.07; 2 1.27,49.53; 3 1.27,46.99; 4 1.27,44.45; 5 1.27,41.91; 6 1.27,39.37; 7 1.27,36.83; 8 1.27,34.29; 9 1.27,31.75; 10 1.27,29.21; 11 1.27,26.67; 12 1.27,24.13; 13 21.59,52.07; 14 21.59,49.53; 15 21.59,46.99; 16 21.59,44.45; 17 21.59,41.91; 18 21.59,39.37; 19 21.59,36.83; 20 21.59,34.29; 21 21.59,31.75; 22 21.59,29.21; 23 21.59,26.67; 24 21.59,24.13; 25 21.59,21.59; 26 21.59,19.05; 27 21.59,16.51; 28 21.59,13.97
PAD_05_03X2_TP_NO4 = smd 1.27 x 1.27: 1 -2.54,-1.27; 2 -2.54,1.27; 3 0,-1.27; 5 2.54,-1.27; 6 2.54,1.27
MICROSD_TINY = smd 0.5 x 1: 1 3.55,-3.85; 2 2.45,-3.85; 3 1.35,-3.85; 4 0.25,-3.85; 5 -0.85,-3.85; 6 -1.95,-3.85; 7 -3.05,-3.85; 8 -4.15,-3.85 | smd 0.72 x 0.78: 9 5.35,-1.17 | smd 1.05 x 1.08: GND1 5.35,0.1 | smd 1.05 x 1.2: GND2 5.35,2.71; GND3 -5.325,2.14 | smd 1.05 x 2.39: GND4 -5.325,-1.045 | smd 2.91 x 0.55: GND5 -2.145,3.385; GND6 2.045,3.385
JST-2-SMD = smd 1 x 4.6: 1 -1,-3.7; 2 1,-3.7 | smd 1.6 x 3.4: NC1 -3.4,1.5; NC2 3.4,1.5
JST04_1MM_RA = smd 0.6 x 1.35: 1 -1.5,0; 2 -0.5,0; 3 0.5,0; 4 1.5,0 | smd 1.2 x 2: NC1 2.8,-3.675; NC2 -2.8,-3.675
COMBO-JUMPER_2_NC_TRACE = smd 0.635 x 1.27: 1 -0.508,0; 2 0.508,0 | drill 1.016 pad 1.88: 3 -1.27,0; 4 1.27,0
SOT23-3 = smd 0.8 x 0.9: 1 -0.95,-1; 2 0.95,-1; 3 0,1.1
TACTILE_SWITCH_SMD_4.6X2.8MM = smd 0.9 x 1: 1 -2.05,-0.8; 2 2.05,-0.8; 3 2.05,0.8; 4 -2.05,0.8
PAD.03X.05 = smd 1.27 x 1.27: 1 0,0
SOT-23-6 = smd 0.55 x 1.35: 1 -0.95,-1.375; 2 0,-1.375; 3 0.95,-1.375; 4 0.95,1.375; 5 0,1.375; 6 -0.95,1.375
NINA_B306 = smd 1.15 x 0.7: 1 4.125,-5.7; 2 4.125,-4.7; 3 4.125,-3.7; 4 4.125,-2.7; 5 4.125,-1.7; 6 4.125,-0.7; 7 4.125,0.3; 8 4.125,1.3; 9 4.125,2.3; 10 4.125,3.3; 16 -4.125,3.3; 17 -4.125,2.3; 18 -4.125,1.3; 19 -4.125,0.3; 20 -4.125,-0.7; 21 -4.125,-1.7; 22 -4.125,-2.7; 23 -4.125,-3.7; 24 -4.125,-4.7; 25 -4.125,-5.7 | smd 0.7 x 1.15: 11 2,3.225; 12 1,3.225; 13 0,3.225; 14 -1,3.225; 15 -2,3.225; 26 -2,-5.625; 27 -1,-5.625; 28 0,-5.625; 29 1,-5.625; 30 2,-5.625 | smd 0.7 x 0.7: 31 2.75,-4.25; 32 2.75,-3.15; 33 2.75,-2.05; 34 2.75,-0.95; 35 2.75,0.15; 36 2.75,1.25; 37 -2.75,1.25; 38 -2.75,0.15; 39 -2.75,-0.95; 40 -2.75,-2.05; 41 -2.75,-3.15; 42 -2.75,-4.25; 43 -1.65,-4.25; 44 -0.55,-4.25; 45 0.55,-4.25; 46 1.65,-4.25; 47 -4,-6.85; 48 -3,-6.85; 49 -2,-6.85; 50 -1,-6.85; 51 0,-6.85; 52 1,-6.85; 53 2,-6.85; 54 3,-6.85; 55 4,-6.85; 56 1.725,0.525; 57 0.575,0.525; 58 -0.575,0.525; 59 -1.725,0.525; 60 0.575,-0.625; 61 -0.575,-0.625; 62 1.725,-1.775; 63 0.575,-1.775; 64 -0.575,-1.775; 65 -1.725,-1.775; 66 0.575,-2.925; 67 -0.575,-2.925; 68 4.35,4.3; 69 4.35,6.85; 70 -4.35,6.85; 71 -4.35,4.3
SOT23-5 = smd 0.55 x 1.2: 1 -0.95,-1.3; 2 0,-1.3; 3 0.95,-1.3; 4 0.95,1.3; 5 -0.95,1.3
DFN-8 = smd 0.3 x 0.7: 1 -0.75,-0.99; 2 -0.25,-0.99; 3 0.25,-0.99; 4 0.75,-0.99; 5 0.75,0.99; 6 0.25,0.99; 7 -0.25,0.99; 8 -0.75,0.99 | smd 1.38 x 0.8: 9 0,0
LGA-14L = smd 0.48 x 0.3: P1 -1.163,0.75; P2 -1.163,0.25; P3 -1.163,-0.25; P4 -1.163,-0.75; P8 1.163,-0.75; P9 1.163,-0.25; P10 1.163,0.25; P11 1.163,0.75 | smd 0.3 x 0.48: P5 -0.5,-1; P6 0,-1; P7 0.5,-1; P12 0.5,1; P13 0,1; P14 -0.5,1
LGA-8-2.5X2.5 = smd 0.35 x 0.5: 1 -0.975,1.025; 2 -0.325,1.025; 3 0.325,1.025; 4 0.975,1.025; 5 0.975,-1.025; 6 0.325,-1.025; 7 -0.325,-1.025; 8 -0.975,-1.025

### Placement (x,y rotation side)
C1  15.8,21.3 0 top
C2  18.4,61.5 0 top
C3  18.4,60.5 0 top
C4  16.46,24.4 180 top
C5  11.1,43.7 0 top
C6  16.95,30.6 90 top
C7  21,12.2 180 top
C8  15.3,38.5 0 top
C9  15.93,15.3 0 top
C10  11,16.7 270 top
C11  9.7,9.1 180 top
C12  10.7,37.3 0 top
C13  8.9,31.8 90 top
C14  8.5,24.1 90 top
C15  12.9,37.3 180 top
C16  7.2,28.9 180 top
CHG  11.8,22.6 90 bottom
D1  11.43,46.13 0 top
D2  7.65,45.74 90 top
D3  14.18,24.4 270 top
D4  15.7,45.74 90 top
D5  11.2,20.7 0 top
FB1  16.4,22.8 0 top
FD1  22.1,5.3 0 top
FD2  0.6,53.4 0 top
FD3  22.1,5.3 0 bottom
FD4  0.6,53.4 0 bottom
FRAME1  63.16,5.63 0 top  (outside the outline)
H1  20.32,55.88 0 top
H2  2.54,55.88 0 top
H3  20.32,2.54 0 top
H4  2.54,2.54 0 top
I2C  3.9,50.7 270 bottom
J1  11.43,6.2 0 top
J2  0,0 0 top
J3  13.53,60.16 180 bottom
J4  12.14,10.8 0 bottom
J5  3.56,17.78 90 top
J6  5.08,8.89 270 top
LOGO1  11.33,33.22 0 bottom
LOGO2  36.8,53.5 0 top  (outside the outline)
LOGO3  35.22,65.32 0 top  (outside the outline)
LOGO4  6.78,8.94 90 top
LOGO5  4.54,61.06 0 top
MEAS  14.2,28.8 90 top
PWR  11.6,42.5 0 bottom
Q1  11.2,24.4 90 top
R1  17.4,5.3 270 top
R2  9.68,7.52 0 top
R3  15.8,20.1 180 top
R4  7.5,43.4 180 top
R5  3.53,48.44 0 top
R6  16.95,28.4 270 top
R7  3.63,50.8 0 top
R8  15.2,43.4 180 top
R9  11.2,22 0 top
R10  17.7,19.6 270 top
R14  13.45,42.2 180 top
R15  7.2,27.9 180 top
R16  9.1,39.86 270 top
S1  21.05,8.61 270 top
SHLD  16.3,3 0 bottom
TP1  15.24,22.86 0 bottom
TP2  11.43,44.45 0 bottom
TP3  5.08,6.35 0 bottom
TP4  5.08,11.43 0 bottom
TP7  7.62,31.75 0 bottom
TP8  6.35,36.83 0 bottom
TP9  13.97,40.64 0 bottom
U1  16.1,10 90 top
U2  11.23,58.24 0 top
U3  15.73,35.76 0 top
U4  14.13,18.15 270 top
U5  6.65,25.21 0 top
U6  11.43,39.37 0 top
U7  6.7,30.9 90 top
U$1  [SFE_LOGO_FLAME_STOP_.1]  2.48,8.86 0 bottom
U$2  [SFE_LOGO_FLAME_.2]  11.43,33.02 0 top
U$3  [#_VU#0]  1.27,29.21 0 top
U$4  [#_EN#47]  1.3,26.7 0 top
U$5  [#3V3_#0]  21.59,16.51 0 top
U$6  [#_44#49]  1.4,31.7 0 top
U$7  [#_1#49]  1.5,34.3 0 top
U$8  [#_2#49]  1.4,36.8 0 top
U$9  [#_3#49]  1.4,39.36 0 top
U$10  [#_4#49]  1.4,41.9 0 top
U$11  [#_25#49]  1.34,44.45 0 top
U$12  [#_35#0]  1.3,47 0 top
U$13  [#_SCL#49]  1.3,49.5 0 top
U$14  [RESET0]  18.8,8.76 90 top
U$16  [#GND_#53]  21.6,21.6 0 top
U$17  [#A0_#54]  21.5,24.1 0 top
U$18  [#A1_#54]  21.26,26.65 0 top
U$19  [#A2_#54]  21.5,29.2 0 top
U$20  [#A3_#54]  21.49,31.79 0 top
U$21  [#A4_#54]  21.5,34.3 0 top
U$22  [#A5_#54]  21.4,36.86 0 top
U$23  [#SCK_#54]  21.6,39.4 0 top
U$24  [#PICO_#60]  21.6,41.9 0 top
U$25  [#POCI_#61]  21.6,44.46 0 top
U$26  [#TXO_#57]  21.6,49.54 0 top
U$27  [#RXI_#59]  21.43,46.96 0 top
U$28  [#38_#60]  21.52,52.04 0 top
U$29  [#_SDA#68]  1.3,52.1 0 top
U$30  [#_CHG#30707]  11.8,23.6 90 bottom
U$31  [#_3V3#0]  21.46,16.51 0 bottom
U$32  [#_GND#70]  21.5,21.6 0 bottom
U$33  [#_A0#71]  21.4,24.1 0 bottom
U$34  [#_A1#71]  21.4,26.65 0 bottom
U$35  [#_A2#71]  21.4,29.2 0 bottom
U$36  [#_A3#71]  21.4,31.8 0 bottom
U$37  [#_A4#71]  21.4,34.3 0 bottom
U$38  [#_A5#71]  21.4,36.86 0 bottom
U$39  [#_SCK#71]  21.4,39.4 0 bottom
U$40  [#_PICO#72]  21.4,41.9 0 bottom
U$41  [#_POCI#73]  21.4,44.46 0 bottom
U$42  [#_TXO#74]  21.4,49.54 0 bottom
U$43  [#_RXI#75]  21.53,46.96 0 bottom
U$44  [#_38#76]  21.4,52.04 0 bottom
U$45  [#35_#0]  4.8,47 0 bottom
U$46  [#25_#79]  1.3,44.4 0 bottom
U$47  [#4_#79]  1.4,41.9 0 bottom
U$48  [#3_#79]  1.4,39.4 0 bottom
U$49  [#2_#79]  1.4,36.8 0 bottom
U$50  [#1_#79]  1.5,34.3 0 bottom
U$51  [#44_#79]  1.4,31.7 0 bottom
U$52  [#VBAT_#0]  1.27,24.13 0 bottom
U$53  [#EN_#80]  1.3,26.7 0 bottom
U$54  [##RST#_#0]  21.46,13.97 0 top
U$55  [#SDA_#82]  8.7,51.7 0 bottom
U$56  [#SCL_#85]  4.6,49.7 0 bottom
U$57  [#_PWR#90]  10.6,42.5 0 bottom
U$58  [#VUSB_#0]  1.27,29.21 0 bottom
U$59  [#_SHLD#93]  15.4,3 0 bottom
U$60  [SPARKFUN_THING_PLUS96]  11.3,64.4 0 bottom
U$61  [NINA#B30697]  11.3,62.8 0 bottom
U$62  [#MEAS#30701]  12.6,28.8 90 top
U$63  [#_VB#0]  1.4,24.13 0 top
U$64  [RGB30710]  11.5,47.8 0 top
U$65  [STAT30711]  6.6,46 90 top
U$66  [PWR30712]  14.6,45.75 90 top
U$67  [NINA#B30630713]  11.43,49.4 0 top
U$68  [X2114]  8.73,37.47 180 top
U$69  [Y2115]  5.75,38.34 0 top
U$70  [Z2116]  5.17,36.2 180 top
U$71  [IO414130630715]  8.8,45.8 90 top
U$72  [IO34414130630716]  11.4,44.5 0 top
U$73  [CHG0]  9.3,19.1 0 top
U$74  [##RST#_#0]  21.6,13.8 90 bottom
U$75  [#3]  8.64,15.62 0 top
U$76  [#4]  8.64,20.07 0 top

### Tracks (layer width: path | path; a pad name or v marks a point on that pad's centre or on a via)
3.3V  (via drill 0.3)
  Top 0.2: C11.1 10.2,8.45 v10.05,8.3 8.49,8.3 7.93,7.74 7.24,7.74 6.1,6.6 4.32,6.6 3.81,7.11 3.81,9.04 4.16,9.39 J6.2 | U7.6 8.82,31.23 C13.1 9.6,31.3 10.6,30.3 v10.6,29.9 10.57,29.93 U7.8 7.72,28.93 C16.1 R15.1 | D1.VCC 10.52,44.97 9.81,44.27 v9.81,43.73 10.57,43.73 C5.1 | U6.P5 10.93,38.03 C12.1 | v14.9,42.2 R14.1 | R16.1 9.47,40.73 v10.08,40.73
  Top 0.4: C8.1 14.78,38.48 U3.5
  Bottom 0.2: v10.05,8.3 v10.06,8.3 10.43,8.67 11.19,8.67 11.89,7.97 J4.4 | J3.1 11.9,60.52 11.9,59.9 12.2,59.6 14.8,59.6 15.5,60.3 v17.1,60.3 | I2C.2 3.1,50.7 2.8,50.4 2.8,48.81 v2.13,48.14 | PWR.2 10.58,42.5 10.08,42 v10.08,40.73
  other vias: 17.1,61.7 17.1,61 14.1,37.1 14.1,37.8 14.1,38.5 14.9,39.4 18.1,15.5 20,17.5 19.8,15 11.9,35.79 11.9,36.39 10.7,36.39 10.7,35.79 14.9,40
  pour Route15 (rank 3): -0.1,66.1 23,66.1 23,0 -0.1,0
  pour Top: 14.9,61.7 15.8,61.7 15.9,61.8 16.1,62 17.3,62 17.5,62 17.8,61.7 18.3,61.7 18.3,60.3 17.8,60.3 17.6,60.1 17.5,60 17.1,60 16.2,60 16,60.2 15.9,60.3 14.9,60.3 14.9,60.79 15.79,60.79 15.8,60.8 15.8,61.3 14.9,61.3
  pour Top: 9.9,37.49 10,37.59 10.3,37.59 11.09,36.8 12.74,36.8 13,36.39 13,35.59 12.8,35.39 10.3,35.39 9.9,35.79
  pour Top: 12.4,38.7 13.2,38.7 14.74,40.24 14.98,40.24 15.13,40.09 15.13,36.53 14,35.4 12.7,35.4 12.7,38 12.4,38.3
!RESET!  (via drill 0.3)
  Top 0.15: S1.3 S1.4 21.85,11.25 21.5,11.6 C7.1 21.5,13.88 J2.28 | U2.19 v7.11,58.51
  Route2 0.15: v7.11,58.51 8.91,58.51 9.7,59.3 17.3,59.3 17.7,58.9 v18.2,58.9
  Route15 0.15: J2.28 19.1,16.46 19.1,53.1 17.8,54.4 17.8,58.5 v18.2,58.9
  Bottom 0.15: v18.2,58.9 J3.6
EN  (via drill 0.3)
  Top 0.15: v16.2,26.5 16.2,27.15 R6.2 17.6,28.55 17.6,31.7 16.68,32.62 U3.3
  Bottom 0.15: J2.11 3.1,28.5 6.5,28.5 10.1,24.9 14.6,24.9 v16.2,26.5
GND  (via drill 0.3)
  Top 0.15: U6.P2 11.08,39.62 11.25,39.45 | U6.P6 11.43,39.27 11.25,39.45 | U6.P3 10.92,39.12 11.25,39.45 | U2.67 v10.78,55.44 | U2.26 9.23,52.89 v9.4,53.06 | U5.6 6.9,25.46 U5.9
  Top 0.3: C14.2 7.78,24.6 U5.4
  other vias: 10.42,19.7 16.9,57.1 6,46.1 8.8,45.3 7.1,12.2 3,10.4 12.8,57.8 11.2,60.2 14.2,60.4 6,62.6 6,65.1 8.3,61.5 16.5,62.6 16.5,65.1 18.9,62.6 18.9,59.4 9.4,30.6 5.7,32.7 5.7,29.2 11.97,37.8 18.7,11.2 14.1,52.6 2.9,43.3 0.6,45.7 0.6,48.26 0.6,50.8 6.4,51.5 10,16.8 14,18.1 17.7,21.3 16.1,31.3 0.6,40.63 0.6,38.1 0.6,35.58 0.6,33 0.6,43.2 4.6,36.2 5.5,25 7.9,25.5 21.2,64.3 1.7,64.3 22.3,50.8 22.22,48.26 22.3,45.7 22.3,43.2 22.3,40.6 22.3,38.1 22.3,35.6 22.3,33 22.3,30.5 22.3,27.9 22.3,25.4 18.1,50.6 11.5,46.1 16.08,39.49 8.4,52.4 16,25.2 16.4,14.5 2.1,16.6 2.1,19.5 14.09,8.28 5.4,1.1 17.5,1.1 20.2,8.5 1.7,53.7 9.42,36.8 9.5,34.1
  pour Top (rank 3): -0.1,66.1 22.9,66.1 22.9,-0.1 0,-0.1 -0.1,-0.1
  pour Route2 (rank 3): -0.1,66.1 22.9,66.1 22.9,-0.1 -0.1,-0.1
  pour Bottom (rank 3): -0.1,66.1 22.9,66.1 22.9,-0.1 -0.1,-0.1
  pour Top (rank 2, no thermals): 12,38.5 12.6,37.9 12.6,37.1 11,37.1 11,37.5 11.4,37.9 11.4,38.5
IO1/GPIO1  (via drill 0.3)
  Top 0.15: U2.1 16.16,52.54 16.52,52.18 v16.52,49.3 | v8.1,39.5 7.9,39.3 v6.3,39.3
  Route2 0.15: v8.1,39.5 8.77,40.17 11.37,40.17 14.8,43.6 14.8,47.2 16.52,48.92 v16.52,49.3 | v6.3,39.3 1.29,34.29 J2.8
IO2/GPIO2  (via drill 0.3)
  Top 0.15: U2.2 16.16,53.54 18.01,51.69 v18.12,51.69 | v6.3,40.1 7.88,40.1 9.04,41.26 10.36,41.26 11,41.9 11.69,41.9 14.5,44.71 v14.5,48
  Route2 0.15: v6.3,40.1 3.4,40.1 2.7,39.4 2.7,38.26 J2.7 | v18.12,51.69 14.5,48.06 v14.5,48
IO3/GPIO3  (via drill 0.3)
  Top 0.15: v18,52.6 17.6,52.6 15.66,54.54 U2.3 | v6.3,40.9 8.29,40.9 8.96,41.57 10.18,41.57 10.88,42.28 11.66,42.28 14.12,44.73 14.12,47.31 13.88,47.56 v13.88,48.42
  Route2 0.15: v6.3,40.9 3.4,40.9 2.8,40.3 2.2,40.3 J2.6 | v18,52.6 13.88,48.48 v13.88,48.42
IO4/GPIO4  (via drill 0.3)
  Top 0.15: U2.4 16.16,55.54 16.7,55 16.7,54.2 v17.6,53.3 | v6.3,41.9 10.02,41.9 10.67,42.55 11.47,42.55 13.75,44.83 13.75,47.1 13.1,47.75 v13.1,48.6
  Route2 0.15: v17.6,53.3 16.8,52.5 16.8,52.3 v13.1,48.6
  Bottom 0.15: v6.3,41.9 J2.5
IO5/NINA_RX/DEV_TX
  Top 0.2: U2.5 16.26,56.54 17.2,55.6 17.2,54.82 19.2,52.82 19.2,49.38 J2.15
IO7/NINA_TX/DEV_RX
  Top 0.2: U2.7 16.46,58.54 17.8,57.2 17.8,54.9 19.8,52.9 19.8,50.1 20.37,49.53 J2.14
IO17/A5  (via drill 0.3)
  Bottom 0.2: J2.19 19.6,38.82 19.6,53.06 18.06,54.6 15.6,54.6 14.7,55.5 13.6,55.5 11.2,57.9 10.64,57.9 7.91,60.64 7.3,60.64 7.21,60.54 U2.17
  other vias: 7.11,60.54
IO18/A4  (via drill 0.3)
  Bottom 0.2: J2.20 18.8,37.08 18.8,52.92 17.83,53.9 15.3,53.9 14.5,54.7 13.3,54.7 10.7,57.3 9.35,57.3 U2.18
  other vias: 7.11,59.54
IO20/A3  (via drill 0.3)
  Bottom 0.2: U2.20 7.95,56.7 10.4,56.7 13.8,53.3 14.39,53.3 18,49.69 18,35.34 J2.21
  other vias: 7.11,57.54
IO21/IMU_INT1  (via drill 0.3)
  Top 0.15: U6.P4 9.92,38.62 9.8,38.5 v8,38.5 | U2.21 5.84,56.54 5.48,56.18 5.48,54.06 6.08,53.46 v6.08,53.06
  Bottom 0.15: TP8.1 8,38.48 v8,38.5 8,38.92 7.32,39.6 7.32,45.1 9.24,47.02 9.5,47.02 10.48,48 10.48,48.8 7.38,51.9 7.38,52.62 7.03,52.97 6.17,52.97 v6.08,53.06
IO22/IMU_INT2  (via drill 0.3)
  Top 0.15: U6.P9 13.12,39.12 13.4,39.4 v13.4,39.8 | U2.22 6.46,55.54 v6,56 | v6.3,42.7 8.22,42.7 v8.7,43.18
  Route2 0.15: v6,56 4.32,54.32 4.32,50.58 6.56,48.34 6.56,45.76 6.3,45.5 v6.3,42.7
  Route15 0.15: v13.4,39.8 13.4,39.82 13.4,42.17 12.37,43.2 8.72,43.2 v8.7,43.18
  Bottom 0.15: v13.4,39.8 13.97,40.37 TP9.1
IO23/A1  (via drill 0.3)
  Top 0.2: 7.11,54.51 U2.23 v7.1,54.55
  Bottom 0.2: J2.23 16.7,31.56 16.7,48.03 12.73,52 9.65,52 v7.1,54.55
IO24/A0  (via drill 0.3)
  Top 0.2: v7.1,53.55 U2.24
  Bottom 0.2: J2.24 15.5,30.22 15.5,48.1 12.6,51 8.9,51 7.8,52.1 7.8,52.85 v7.1,53.55
IO25/GPIO5  (via drill 0.3)
  Top 0.15: v6.82,52.44 7,52.44 U2.25
  Bottom 0.15: v6.82,52.44 6.32,52.44 5.62,51.73 5.62,49.73 3.07,47.17 3.07,46.05 1.47,44.45 J2.4
IO27/A2  (via drill 0.3)
  Top 0.2: U2.27
  Bottom 0.2: J2.22 17.4,33.4 17.4,49.36 14.86,51.9 13.7,51.9 12.98,52.62 U2.27
  other vias: 10.23,52.62
IO34/RGB  (via drill 0.3)
  Top 0.15: v11.8,48.4 10.52,47.12 D1.DI
  Route2 0.15: U2.34 12.6,55.91 12.6,49.2 v11.8,48.4
  other vias: 13.98,57.29
IO35/GPIO6  (via drill 0.3)
  Top 0.15: v6,46.99 7.51,48.5 9,48.5 9.6,47.9 9.62,47.9 9.7,47.82 10.32,47.82 v11.6,49.1
  Route2 0.15: U2.35 13.35,57.76 13.35,57.17 12.2,56.02 12.2,49.7 v11.6,49.1 | J2.3 v6,46.99
  other vias: 13.98,58.39
IO37/SD_DET  (via drill 0.3)
  Top 0.15: U2.37 v8.36,59.37 | v5.1,59 5,58.9 v5,53.5
  Route2 0.15: v8.36,59.37 7.76,59.37 7.38,58.99 5.11,58.99 v5.1,59 | v2.9,32.9 v2.9,16.6 | v5,53.5 5.3,53.2 5.3,52.7 5.49,52.51 5.49,49.98 6.88,48.59 6.88,41.81 6.5,41.42 3.03,41.42 v2.91,41.3 v2.9,41.3
  Bottom 0.15: J4.9 6.76,9.6 6,9.6 5.08,10.52 TP4.1 2.9,13.61 v2.9,16.6 | v2.9,41.3 v2.9,32.9
IO38/FREE  (via drill 0.3)
  Top 0.15: U2.38 8.94,57.93 v9.53,57.93
  Route2 0.15: J2.13 20.31,53.35 19.77,53.35 14.37,58.75
  Route2 0.152: 14.37,58.75 14.1,59.02 10.62,59.02 v9.53,57.93
IO39/!BATT_ALRT!  (via drill 0.3)
  Top 0.15: U5.5 7.4,26.9 7.18,27.12 v6.74,27.12
  Route2 0.15: v6.74,27.12 6.74,34.96 v6.7,35 6.7,38.7 6.9,38.9 6.9,41.2 7.2,41.5 7.2,48.8 5.8,50.2 5.8,52.66 5.6,52.86 5.6,54.41 U2.39
  Bottom 0.15: TP7.1 6.7,32.67 v6.7,35
  other vias: 8.48,57.29
IO40/QWIIC_!PEN!  (via drill 0.3)
  Top 0.15: U2.40 v8.48,56.12
  Route15 0.15: v11.3,19.8 11.3,32.41 14.75,35.85 14.75,38.71 14.28,39.17 14.28,44.44 13.28,45.44 13.28,47.22 12.6,47.9 12.6,52.1 11.26,53.44 11.26,54.19 9.32,56.12 v8.48,56.12
  Bottom 0.15: v11.3,19.8 11.3,19.3 11.43,19.17
IO41/LED  (via drill 0.3)
  Top 0.15: R4.1 9.47,44.87 v9.47,46.48 | v9.6,54.9 v9.59,54.89 9.18,54.89 8.98,55.09 U2.41
  Route15 0.15: v9.47,46.48 10.68,46.48 12.3,48.1 12.3,51.4 10.2,53.5 10.2,54.3 v9.6,54.9
IO42/SCL  (via drill 0.3)
  Top 0.15: J6.4 5.89,7.39 6.5,8 6.5,14.2 v4.9,15.8 | R5.1 3.03,48.97 2.47,49.53 J2.2 | 4.45,28.8 4.45,31.35 4.97,31.88 U7.4 6.08,31.88 6.3,32.1 6.3,32.9 v5,34.2 | U6.P13 11.43,40.77 11.66,41 v11.66,41.31 v11.67,41.32
  Top 0.152: U5.7 6.4,26.67 v5.8,27.27 4.45,28.62 4.45,28.8
  Route2 0.15: v11.67,41.32 11.67,43.19 11.67,43.2 11.67,45.06 9.7,47.03 9.68,47.03 v8.77,47.95
  Route15 0.15: J2.2 1.47,49.33 4.79,49.33 6.72,47.39 8.27,47.39 8.77,47.89 v8.77,47.95
  Bottom 0.15: v4.9,15.8 4.9,25.2 5.8,26.1 | U2.42 7.36,55.11 5.81,55.11 2.8,52.1 2.8,51.16 1.27,49.63 J2.2 | v5,34.2 6.4,35.6 7,35.6 11.67,40.27 v11.67,41.32
  Bottom 0.152: 5.8,26.1 v5.8,27.27
  other vias: 8.48,53.99
IO43/SDA  (via drill 0.3)
  Top 0.15: J6.3 5.89,8.39 6.13,8.63 6.13,13.47 v4.4,15.2 | R7.1 2.54,50.8 J2.1 | v5.04,31.23 U7.3 6.12,31.23 6.6,31.7 6.6,33.7 v5.1,35.2 | U6.P14 v10.93,40.99 v10.94,41
  Top 0.152: U5.8 5.34,26.2 5.2,26.34 v5.2,26.7
  Route2 0.15: v5.04,31.23 4.74,30.93 4.74,27.08 5.12,26.7 v5.2,26.7 | v10.94,41 10.94,42.88 11.37,43.32 11.37,43.8 8.05,47.12 v8.05,47.89
  Route15 0.15: v8.05,47.89 6.95,47.89 2.77,52.07 J2.1
  Bottom 0.15: v5.2,26.7 5.2,26.2 4.4,25.4 v4.4,15.2 | U2.43 8.15,55.42 5.52,55.42 3.3,53.2 2.4,53.2 J2.1 | v5.1,35.2 5.8,35.9 6.8,35.9 10.94,40.04 v10.94,41
  other vias: 9.58,53.99
IO44/GPIO0  (via drill 0.3)
  Route2 0.15: U2.44 11.9,52.77 11.9,50.3 v9.9,48.3
  Bottom 0.15: J2.9 2.77,31.75 3.7,32.68 3.7,37.5 5.6,39.4 5.6,40.88 6.1,41.38 6.56,41.38 6.8,41.62 6.8,45.2 v9.9,48.3
  other vias: 10.68,53.99
IO48/POCI  (via drill 0.3)
  Top 0.2: v12,30.7 11.9,30.7 3.5,39.1 3.5,46.9 7.1,50.5 7.9,50.5 8.23,50.83 U2.48
  Route2 0.2: J2.16 19.98,42.84 19.98,41.98 v13.6,35.6
  Route15 0.2: v12,30.7 12,8.4 12.8,7.6 14.7,7.6 v15.2,8.1
  Bottom 0.2: J4.7 v15.19,8.09 v15.2,8.1 | v13.6,35.6 13.6,33.8 11.9,32.1 11.9,31.2 12,31.1 v12,30.7
IO50/PICO  (via drill 0.3)
  Top 0.2: v8.7,34.9 4.4,39.2 4.4,47 7.2,49.8 9.2,49.8 10.23,50.83 U2.50
  Route2 0.2: J2.17 14.58,34.9 v8.7,34.9
  Route15 0.2: v10.91,7.99 10.91,18.19 8.7,20.4 v8.7,34.9
  Bottom 0.2: J4.3 10.79,7.58 10.91,7.69 v10.91,7.99
IO51/SD_!CS!  (via drill 0.3)
  Top 0.15: U2.51 11.23,50.83 v10.7,50.3
  Route2 0.15: v10.7,50.3 9.6,50.3 7.5,48.2 7.5,41.28 7.22,41 7.22,12.98 7.7,12.5 v7.7,8.3
  Bottom 0.15: TP3.1 6.23,6.35 6.59,6.71 7.6,6.71 8.26,6.05 9.49,6.05 9.69,6.25 J4.2 9.69,7.61 9.4,7.9 8.1,7.9 v7.7,8.3
IO52/SCK  (via drill 0.3)
  Top 0.2: v12.9,31.6 12.9,31.7 5.2,39.4 5.2,47.03 7.17,49 10.4,49 12.23,50.83 U2.52
  Route2 0.2: v12.9,31.6 13.82,31.6 J2.18
  Route15 0.2: v12.97,8.17 12.97,31.53 v12.9,31.6
  Bottom 0.2: J4.5 12.99,8.15 v12.97,8.17
N$2  (via drill 0.3)
  Top 0.15: J1.B5 13.18,5.26 12.88,4.97 v12.88,4.42 | v12.88,4.42 | v17.4,4.1 R1.2
  Route2 0.15: v12.88,4.42 13.8,3.5 16.8,3.5 v17.4,4.1
N$3
  Top 0.15: J1.A5 R2.2
N$4
  Top 0.15: R9.1 10.32,21.62 D5.A
N$5
  Top 0.2: D5.C 12.83,19.95 U4.1
N$6
  Top 0.4: U4.5 R10.2
N$8  (via drill 0.3)
  Top 0.15: R9.2 11.7,22.5 11.4,22.8 v10.33,22.8
  Bottom 0.15: v10.33,22.8 11.05,22.08 CHG.1
N$10
  Top 0.15: R8.1 D4.A
N$11  (via drill 0.3)
  Top 0.15: R8.2 13.87,43.4 v13.53,43.06 v13.52,43.06
  Bottom 0.15: v13.52,43.06 12.97,42.5 PWR.1
N$12
  Top 0.4: Q1.2 13.05,25.35 13.25,25.55 D3.C 14.2,25.57 MEAS.3 MEAS.1
N$14  (via drill 0.3)
  Top 0.15: D1.DO 12.82,45.58 13.1,45.3 v13.1,44.9
  Bottom 0.15: v13.1,44.9 12.66,44.46 TP2.1
N$15
  Top 0.15: R15.2 5.9,27.9 4.9,28.9 4.9,30.3 5.17,30.57 U7.2
N$16
  Top 0.15: R4.2 7,44.21 D2.A
N$18
  Top 0.15: R14.2 12.95,41.79 11.93,40.77 U6.P12
N$19
  Top 0.15: R16.2 9.86,40.12 U6.P1
N$20  (via drill 0.3)
  Top 0.4: C4.1 16.96,23.74 v17,23.7 17,22.82 FB1.2
  Route15 0.4: U2.31 15.9,52.07 15.9,48.8 18.3,46.4 18.3,25 v17,23.7
  Bottom 0.15: v17,23.7 16.08,23.7 TP1.1
  other vias: 13.98,53.99
SCL_PU_PWR  (via drill 0.3)
  Top 0.15: v4.94,51.46 4.94,49.35 R5.2
  Bottom 0.15: v4.94,51.46 4.94,49.94 4.66,49.66 I2C.3
SDA_PU_PWR  (via drill 0.3)
  Top 0.15: v4.81,52.81 4.13,52.13 R7.2
  Bottom 0.15: v4.81,52.81 4.31,52.81 3.9,52.4 I2C.1
SHLD  (via drill 0.3)
  Bottom 0.2: 14.9,3.8 v14.9,4.1
  other vias: 8,4.1 8.2,1.1 14.7,1.1
  pour Top (rank 2): 7.1,5.3 7.1,-0.1 15.8,-0.1 15.8,5.3
  pour Route2: 7.1,5.3 7.1,0 15.8,0 15.8,5.3
  pour Bottom: 7.1,5.3 7.1,0 15.8,0 15.8,5.3
SWCLK  (via drill 0.3)
  Top 0.2: v12.8,60.3 13.23,60.73 U2.11
  Bottom 0.2: J3.3 12.8,60.7 v12.8,60.3
SWDIO  (via drill 0.3)
  Top 0.2: U2.15 9.23,60.67 v10,59.9
  Bottom 0.2: v10,59.9 10.99,58.91 J3.2
USB_N
  Top 0.2: J1.B7 10.68,5.15 10.56,5.03 10.56,4.62 10.88,4.3 11.33,4.3 11.68,4.65 J1.A7 11.68,6.98 12.05,7.35 12.05,8.7 12.4,9.05 U1.6 15.6,9.05 16.15,9.6 16.15,11.05 19.15,14.05 19.15,45.84 15.23,49.77 U2.55
USB_P  (via drill 0.3)
  Top 0.2: v11.1,4.83 11.18,4.91 J1.A6 11.18,6.97 11.7,7.5 11.7,8.87 13.78,10.95 U1.4 15.55,10.95 18.8,14.2 18.8,45.7 14.23,50.27 U2.54 | v12.21,4.9 12.18,4.93 J1.B6
  Bottom 0.2: v11.1,4.83 12.13,4.83 v12.21,4.9
V_BATT
  Top 0.2: U5.2 6.4,23.5 | U5.3 6.9,23.5
  pour Top: -0.1,25.5 1.9,25.5 2.8,24.6 3.5,24.6 3.5,24.2 3.9,23.8 8.8,23.8 9.7,24.7 10.45,24.7 10.45,23.65 9.45,22.65 9.45,18.45 9.4,18.4 5.1,18.4 5.05,18.45 5.05,21.05 3.8,22.3 -0.1,22.3
  pour Top: 13.3,17.4 13.3,16.9 10.6,16.9 9.84,17.66 4.04,17.66 4.04,22.1 7.3,22.1 12,17.4
V_USB  (via drill 0.3)
  Top 0.2: J1.VBUS1 8.98,5.32 9.2,5.1 9.2,4.7 9.24,4.66 | 13.6,4.8 13.6,5 13.88,5.28 J1.VBUS2 | U1.5 v13.7,10
  Top 0.38: 9.24,4.66 9.24,4.16
  Top 0.4: 13.6,4.8 13.61,4.79 13.61,4.21 13.1,3.7 v12.6,3.7 v11.3,3.7 v10,3.7 9.7,3.7 9.24,4.16 | U4.4 v15.43,16.3 | v15.43,16.3 | v15.43,16.3 C9.1
  Bottom 0.2: CHG.2 13.38,23.12 v14.2,22.3
  other vias: 14.2,21.3 14.2,20.1
  pour Top (no thermals): 8.7,5.6 8.7,5.3 9.02,4.98 9.02,4.55 9.4,4.55 9.4,5.21 9.2,5.41 9.2,5.6
  pour Top (no thermals): 13.6,5.7 14.16,5.7 14.16,5.26 13.8,4.9 13.8,4.55 13.42,4.55 13.42,5.11 13.6,5.29
  pour Route15 (rank 2): -0.1,30.4 2.1,30.4 3.4,29.1 3.4,9.2 7.1,5.5 13.2,5.5 13.2,22.5 13.7,23 14.9,23 15.4,22.5 15.4,17.5 23,9.9 23,0 -0.1,0
  pour Top: 15.5,19.9 15,19.9 14.8,19.7 14.7,19.6 13.6,19.6 12.9,20.3 12.9,21 12.9,22.1 11.9,23.1 11.9,23.7 13.6,23.7 13.84,23.46 14,23.46 15.04,23.46 15.2,23.3 15.35,23.15 15.69,23.15 15.95,23.15 16.1,23 16.1,22.5 15.9,22.5 15.6,22.2 15.5,22.1 15.5,21.1
VIN
  Top 0.2: R6.1 C6.1
  Top 0.4: MEAS.4 14.2,31.6 14.8,32.2 14.8,34.44 U3.1 | MEAS.2 MEAS.4 | MEAS.4 14.23,30.1 C6.1

### Text on the board
Top: 1
Route2: 2
Route15: 3
Bottom: 4 | v10
Measures: All measurements in inches.
tDocu: Alex Brudner